# EAGLE design M0 DC Closed Loop Servo (EAGLE 8.4.3)
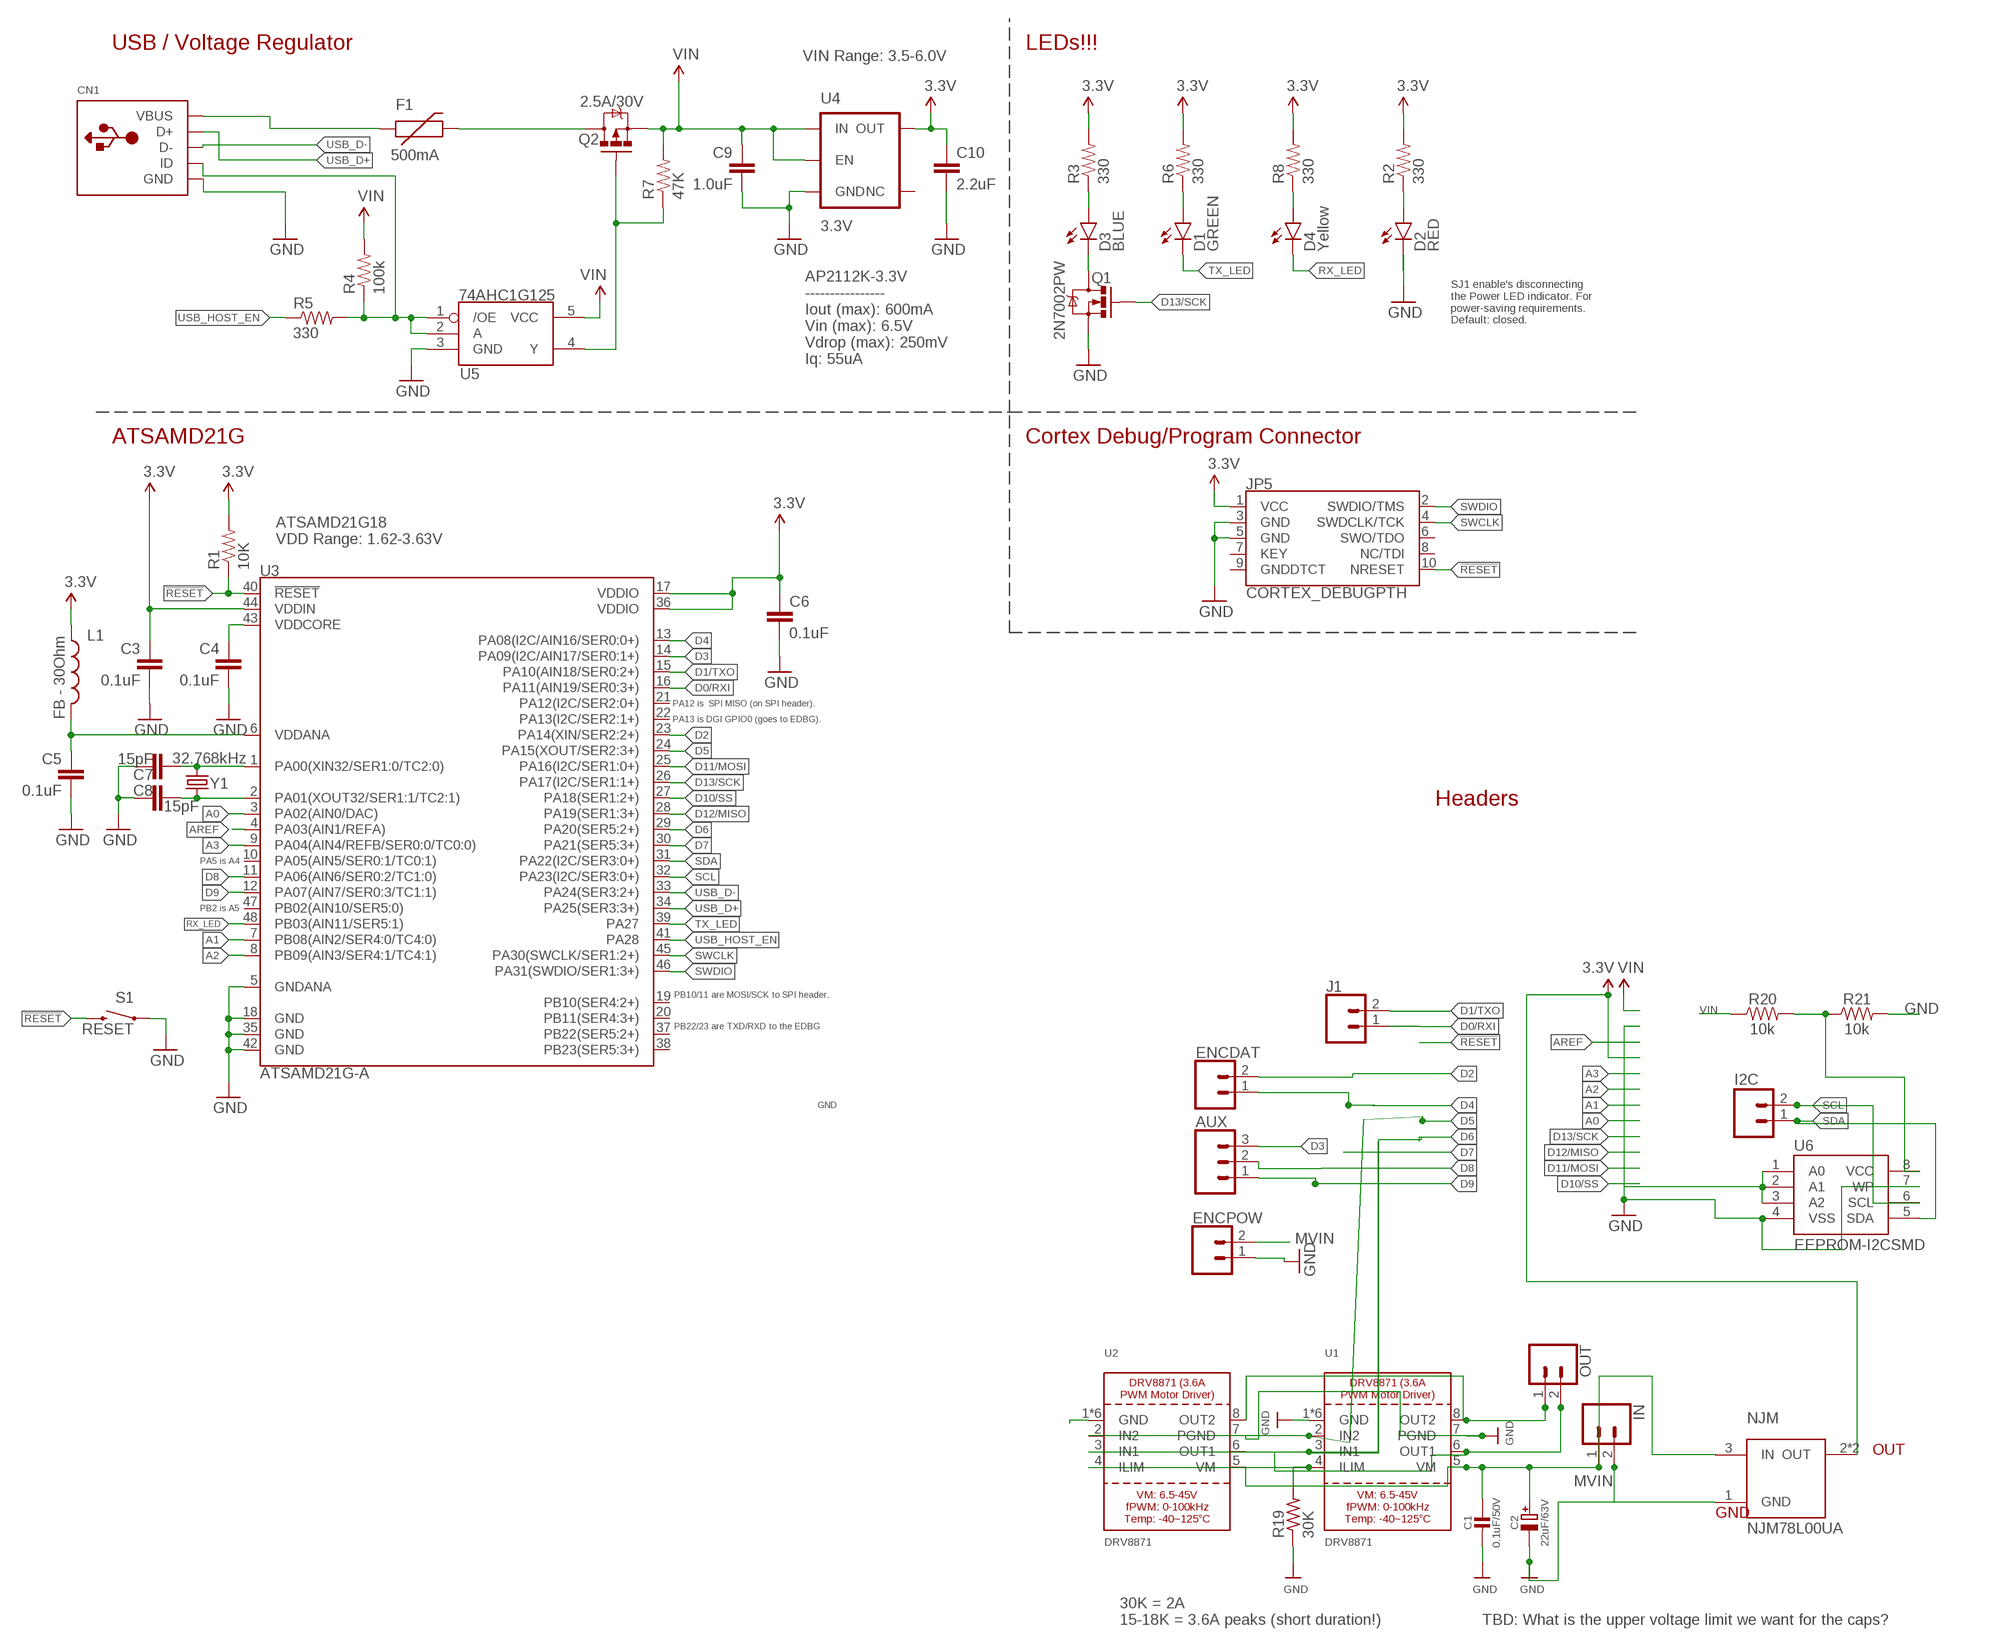
[diagram p0: schematic, sheet 1]

## Parts
AUX  CONN_03LONGPADS  [1X03_LONGPADS]
C1  0.1uF/50V  CAP_CERAMIC0805-NOOUTLINE  [0805-NO]
C2  22uF/63V  CAP_ELECTROLYTICPANASONIC_D  [PANASONIC_D]
C3  0.1uF  0.1UF-16V(+-10%)(0402)  [0402-CAP]
C4  0.1uF  0.1UF-16V(+-10%)(0402)  [0402-CAP]
C5  0.1uF  0.1UF-16V(+-10%)(0402)  [0402-CAP]
C6  0.1uF  0.1UF-16V(+-10%)(0402)  [0402-CAP]
C7  15pF  15PF-50V(+-5%)(0402)  [0402-CAP]
C8  15pF  15PF-50V(+-5%)(0402)  [0402-CAP]
C9  1.0uF  1.0UF-25V-+80/-20(0805)"  [0805-CAP]
C10  2.2uF  2.2UF-10V-20%(0603)  [0603-CAP]
CN1  USBMINIB  [USB-MINIB]
D1  GREEN  LED-GREEN0603  [LED-0603]
D2  RED  LED-RED0603  [LED-0603]
D3  BLUE  LED-BLUE0603  [LED-0603]
D4  Yellow  LED-YELLOW0603  [LED-0603]
ENCDAT  CONN_02  [1X02]
ENCPOW  CONN_02  [1X02]
F1  500mA  PTCSMD  [PTC-1206]
I2C  M021X02_NO_SILK  [1X02_NO_SILK@1]
IN  CONN_02PTH3  [1X02_LONGPADS]
J1  CONN_02  [1X02]
JP5  CORTEX_DEBUGPTH  [2X5-PTH-1.27MM]
L1  FB - 30Ohm  INDUCTOR0603  [0603]
NJM  NJM78L00UA  AP1117Y33G-13  [SOT89]
OUT  CONN_02PTH3  [1X02_LONGPADS]
Q1  2N7002PW  MOSFET-NCHANNEL2N7002PW  [SOT323]
Q2  2.5A/30V  MOSFET-PCHANNELDMG2307L  [SOT23-3]
R1  10K  10KOHM-1/10W-1%(0603)0603  [0603-RES]
R2  330  330OHM1/10W1%(0603)  [0603-RES]
R3  330  330OHM1/10W1%(0603)  [0603-RES]
R4  100k  100KOHM-1/10W-1%(0603)  [0603-RES]
R5  330  330OHM1/10W1%(0603)  [0603-RES]
R6  330  330OHM1/10W1%(0603)  [0603-RES]
R7  47K  47KOHM1/10W1%(0603)  [0603-RES]
R8  330  330OHM1/10W1%(0603)  [0603-RES]
R19  30K  FLIPFLOP-RES  [0805-THM]
R20  10k  10KOHM-0603-1/10W-1%  [0603]
R21  10k  10KOHM-0603-1/10W-1%  [0603]
S1  RESET  SWITCH-MOMENTARY-2SMD-4.6X2.8MM  [TACTILE_SWITCH_SMD_4.6X2.8MM]
U1  DRV8871  [HSOP8]
U2  DRV8871  [HSOP8]
U3  ATSAMD21G-A  [TQFP-48]
U4  3.3V  V_REG_AP2112K-3.3V  [SOT23-5]
U5  74AHC1G125  [SOT23-5]
U6  EEPROM-I2CSMD  [SO08]
Y1  32.768kHz  CRYSTAL3.2X1.5MM  [CRYSTAL-SMD-3.2X1.5MM]

## Nets
3.3V: C3.1 C6.1 C10.1 JP5.1(VCC) L1.1 NJM.2(OUT) NJM.2@1(OUT) R1.2 R2.2 R3.2 R6.2 R8.2 U3.17(VDDIO) U3.36(VDDIO) U3.44(VDDIN) U4.5(OUT)
!RESET: JP5.10(NRESET) R1.1 S1.3 S1.4 U3.40(!RESET!)
A0: U3.3(PA02(AIN0/DAC))
A1: U3.7(PB08(AIN2/SER4:0/TC4:0))
A2: U3.8(PB09(AIN3/SER4:1/TC4:1))
A3: U3.9(PA04(AIN4/REFB/SER0:0/TC0:0))
AREF: U3.4(PA03(AIN1/REFA))
D0/RXI: J1.1 U3.16(PA11(AIN19/SER0:3+))
D1/TXO: J1.2 U3.15(PA10(AIN18/SER0:2+))
D2: ENCDAT.2 U3.23(PA14(XIN/SER2:2+))
D3: AUX.3 U3.14(PA09(I2C/AIN17/SER0:1+))
D4: ENCDAT.1 U3.13(PA08(I2C/AIN16/SER0:0+))
D5: U1.2(IN2) U2.2(IN2) U3.24(PA15(XOUT/SER2:3+))
D6: U1.3(IN1) U2.3(IN1) U3.29(PA20(SER5:2+))
D7: U3.30(PA21(SER5:3+))
D8: AUX.2 U3.11(PA06(AIN6/SER0:2/TC1:0))
D9: AUX.1 U3.12(PA07(AIN7/SER0:3/TC1:1))
D10/SS: U3.27(PA18(SER1:2+))
D11/MOSI: U3.25(PA16(I2C/SER1:0+))
D12/MISO: U3.28(PA19(SER1:3+))
D13/SCK: Q1.1(G) U3.26(PA17(I2C/SER1:1+))
GND: C1.2 C2.- C3.2 C4.2 C5.2 C6.2 C7.1 C8.2 C9.2 C10.2 CN1.GND ENCPOW.1 IN.2 JP5.3(GND) JP5.5(GND) NJM.1(GND) Q1.2(S) R19.1 R21.2 S1.1 S1.2 U1.1(GND) U1.7(PGND) U1.GND U1.P$1(GND) U1.P$2(GND) U1.P$3(GND) U1.P$4(GND) U2.1(GND) U2.7(PGND) U2.GND U2.P$1(GND) U2.P$2(GND) U2.P$3(GND) U2.P$4(GND) U3.5(GNDANA) U3.18(GND) U3.35(GND) U3.42(GND) U4.2(GND) U5.3(GND) U6.1(A0) U6.2(A1) U6.3(A2) U6.4(VSS) U6.7(WP)
MVIN: C1.1 C2.+ ENCPOW.2 IN.1 NJM.3(IN) U1.5(VM) U2.5(VM)
N$1: CN1.VBUS F1.1
N$2: C7.2 U3.1(PA00(XIN32/SER1:0/TC2:0)) Y1.P$2
N$3: D3.C Q1.3(D)
N$4: C8.1 U3.2(PA01(XOUT32/SER1:1/TC2:1)) Y1.P$1
N$5: D2.A R2.1
N$6: D3.A R3.1
N$7: F1.2 Q2.3(D)
N$8: CN1.ID R4.1 R5.2 U5.1(/OE) U5.2(A)
N$9: Q2.1(G) R7.1 U5.4(Y)
N$10: D1.A R6.1
N$11: D4.A R8.1
N$12: D2.C
N$15: R20.2 R21.1 U6.8(VCC)
N$20: R19.2 U1.4(ILIM) U2.4(ILIM)
OUT1: OUT.2 U1.6(OUT1) U2.6(OUT1)
OUT2: OUT.1 U1.8(OUT2) U2.8(OUT2)
RX_LED: D4.C U3.48(PB03(AIN11/SER5:1))
SCL: I2C.2 U3.32(PA23(I2C/SER3:0+)) U6.6(SCL)
SDA: I2C.1 U3.31(PA22(I2C/SER3:0+)) U6.5(SDA)
SWCLK: JP5.4(SWDCLK/TCK) U3.45(PA30(SWCLK/SER1:2+))
SWDIO: JP5.2(SWDIO/TMS) U3.46(PA31(SWDIO/SER1:3+))
TX_LED: D1.C U3.39(PA27)
USB_D+: CN1.D+ U3.34(PA25(SER3:3+))
USB_D-: CN1.D- U3.33(PA24(SER3:2+))
USB_HOST_EN: R5.1 U3.41(PA28)
VDDANA: C5.1 L1.2 U3.6(VDDANA)
VDDCORE: C4.1 U3.43(VDDCORE)
VIN: C9.1 Q2.2(S) R4.2 R7.2 R20.1 U4.1(IN) U4.3(EN) U5.5(VCC)
Unconnected: JP5.6(SWO/TDO) JP5.7(KEY) JP5.8(NC/TDI) JP5.9(GNDDTCT) U3.10(PA05(AIN5/SER0:1/TC0:1)) U3.19(PB10(SER4:2+)) U3.20(PB11(SER4:3+)) U3.21(PA12(I2C/SER2:0+)) U3.22(PA13(I2C/SER2:1+)) U3.37(PB22(SER5:2+)) U3.38(PB23(SER5:3+)) U3.47(PB02(AIN10/SER5:0)) U4.4(NC)

## Notes on the sheet
- USB / Voltage Regulator | LEDs!!!
- VIN Range: 3.5-6.0V
- AP2112K-3.3V
  ----------------
  Iout (max): 600mA 
  Vin (max): 6.5V
  Vdrop (max): 250mV
  Iq: 55uA
- SJ1 enable's disconnecting
  the Power LED indicator. For
  power-saving requirements.
  Default: closed.
- ATSAMD21G | Cortex Debug/Program Connector
- ATSAMD21G18
  VDD Range: 1.62-3.63V
- PA12 is  SPI MISO (on SPI header).
- PA13 is DGI GPIO0 (goes to EDBG).
- Headers
- PA5 is A4
- PB2 is A5
- PB10/11 are MOSI/SCK to SPI header.
- PB22/23 are TXD/RXD to the EDBG
- OUT
- GND
- 30K = 2A
  15-18K = 3.6A peaks (short duration!)
- TBD: What is the upper voltage limit we want for the caps?

## Library data of the parts
AUX = SparkFun-Connectors:CONN_03: Multi connection point. Often used as Generic Header-pin footprint for 0.1 inch spaced/style header connections On any of the 0.1 inch spaced packages, you can populate with these: Break Away Headers - Straight <https://www.sparkfun.com/products/116> (PRT-00116) Break Away Male Headers - Right Angle <https://www.sparkfun.com/products/553> (PRT-00553) Female Headers <https://www.sparkfun.com/products/115> (PRT-00115) Break Away Headers - Machine Pin <https://www.sparkfun.com/products/117> (PRT-00117) Break Away Female Headers - Swiss Machine Pin <https://www.sparkfun.com/products/743> (PRT-00743) Stackable Header - 3 Pin (Female, 0.1") <https://www.sparkfun.com/products/13875> (PRT-13875) For SCREWTERMINALS and SPRING TERMINALS visit here: Screw Terimnals on SparkFun.com <https://www.sparkfun.com/search/results?term=Screw+Terminals> (5mm/3.5mm/2.54mm spacing) This device is also useful as a general connection point to wire up your design to another part of your project. Our various solder wires solder well into these plated through hole pads. Hook-Up Wire - Assortment (Stranded, 22 AWG) <https://www.sparkfun.com/products/11375> (PRT-11375) Hook-Up Wire - Assortment (Solid Core, 22 AWG) <https://www.sparkfun.com/products/11367> (PRT-11367) View the entire wire category on our website here <https://www.sparkfun.com/categories/141> Special notes: Molex polarized connector foot print use with SKU : PRT-08232 with associated crimp pins and housings.
C1 = microbuilder:CAP_CERAMIC: Ceramic Capacitors For new designs, use the packages preceded by an '_' character since they are more reliable: The following footprints should be used on most boards: _0402 - Standard footprint for regular board layouts _0603 - Standard footprint for regular board layouts _0805 - Standard footprint for regular board layouts _1206 - Standard footprint for regular board layouts For extremely tight-pitch boards where space is at a premium, the following 'micro-pitch' footprints can be used (smaller pads, no silkscreen outline, etc.): _0402MP - Micro-pitch footprint for very dense/compact boards _0603MP - Micro-pitch footprint for very dense/compact boards _0805MP - Micro-pitch footprint for very dense/compact boards _1206MP - Micro-pitch footprint for very dense/compact boards
C2 = microbuilder:CAP_ELECTROLYTIC: Electrolytic Capacitors SMT PANASONIC_C - Size C Panasonic Electrolytic Aluminum Capacitor 47µF 16V 20% Electrolytic Capacitor [Digikey: PCE3890TR-ND] PANASONIC_D - Size D Panasonic Electrolytic Aluminum Capacitor 100µF 25V 20% Electrolytic Capacitor [Digikey: PCE3898TR-ND] PTH 3.5 mm grid, 8 mm diameter ... 3.5 mm grid, 10 mm diameter ...
C3-C6 = SparkFun-Capacitors:0.1UF-16V(+-10%)(0402); PROD_ID: CAP-12416
C7 C8 = samd21-temp:15PF-50V(+-5%)(0402); PROD_ID: CAP-13063
C9 = SparkFun-Capacitors:1.0UF-25V-+80/-20(0805): CAP-11625; PROD_ID: CAP-11625
C10 = SparkFun-Capacitors:2.2UF-10V-20%(0603): CAP-07888; PROD_ID: CAP-07888
CN1 = adafruit:USB: USB Connectors USBMINIB - Surface Mount Female Mini-B USB Connector 4UConnector: 06564 By microbuilder.eu Thru-hole RA Female Mini-B USB Connector 4UConnector: 18732 By ladyada.net
D1 = SparkFun-LED:LED-GREEN: Various green LEDs Green LEDs used in SFE Production 0603- DIO-00821 LARGE- DIO-00862 LILYPAD- DIO-09910; PROD_ID: DIO-00821
D2 = SparkFun-LED:LED-RED: Assorted Red LEDs LilyPad 1206- DIO-09912 1206- DIO-00809 0603- DIO-00819 "SMART" means more efficient and expensive; PROD_ID: DIO-00819
D3 = SparkFun-LED:LED-BLUE: Blue LEDs for production use Various blue LEDs stocked by SparkFun production 0603 - DIO-08575 Rebel - DIO-09553 1206 - DIO-09911; PROD_ID: DIO-08575
D4 = SparkFun-LED:LED-YELLOW: Yellow SMD LEDs LilyPad 1206- DIO-09909 0603- DIO-09003 "SMART" means more efficient and expensive; PROD_ID: DIO-09003
ENCDAT ENCPOW IN J1 OUT = SparkFun-Connectors:CONN_02: Multi connection point. Often used as Generic Header-pin footprint for 0.1 inch spaced/style header connections On any of the 0.1 inch spaced packages, you can populate with these: Break Away Headers - Straight <https://www.sparkfun.com/products/116> (PRT-00116) Break Away Male Headers - Right Angle <https://www.sparkfun.com/products/553> (PRT-00553) Female Headers <https://www.sparkfun.com/products/115> (PRT-00115) Break Away Headers - Machine Pin <https://www.sparkfun.com/products/117> (PRT-00117) Break Away Female Headers - Swiss Machine Pin <https://www.sparkfun.com/products/743> (PRT-00743) For SCREWTERMINALS and SPRING TERMINALS visit here: Screw Terimnals on SparkFun.com <https://www.sparkfun.com/search/results?term=Screw+Terminals> (5mm/3.5mm/2.54mm spacing) This device is also useful as a general connection point to wire up your design to another part of your project. Our various solder wires solder well into these plated through hole pads. Hook-Up Wire - Assortment (Stranded, 22 AWG) <https://www.sparkfun.com/products/11375> (PRT-11375) Hook-Up Wire - Assortment (Solid Core, 22 AWG) <https://www.sparkfun.com/products/11367> (PRT-11367) View the entire wire category on our website here <https://www.sparkfun.com/categories/141> Special notes: Molex polarized connector foot print use with: PRT-08233 with associated crimp pins and housings. 2.54_SCREWTERM for use with PRT-10571. 3.5mm Screw Terminal footprints for PRT-08084 5mm Screw Terminal footprints for use with PRT-08432
F1 = SparkFun-PowerIC:PTC: Resettable Fuse PTC Resettable Fuse. Spark Fun Electronics SKU : COM-08357; PROD_ID: RES-11150
I2C = SparkFun-Connectors:M02: Standard 2-pin 0.1" header. Use with - straight break away headers ( PRT-00116) - right angle break away headers (PRT-00553) - swiss pins (PRT-00743) - machine pins (PRT-00117) - female headers (PRT-00115) Molex polarized connector foot print use with: PRT-08233 with associated crimp pins and housings. 2.54_SCREWTERM for use with PRT-10571. 3.5mm Screw Terminal footprints for PRT-08084 5mm Screw Terminal footprints for use with PRT-08432
JP5 = samd21-temp:CORTEX_DEBUG: Cortex Debug Connector Datasheet <http://infocenter.arm.com/help/topic/com.arm.doc.faqs/attached/13634/cortex_debug_connectors.pdf>
L1 = SparkFun-Passives:INDUCTOR: Inductors Basic Inductor/Choke - 0603 and 1206. Footprints are not proven and vary greatly between part numbers. INDUCTOR POWER 3.3UH 4.0A SMD 0.197" L x 0.197" W x 0.177" H (5.00mm x 5.00mm x 4.50mm); PROD_ID: RES-07859
NJM = AP1117Y33G-13:AP1117Y33G-13
Q1 = SparkFun-DiscreteSemi:MOSFET-NCHANNEL: Common NMOSFET Parts MFG P/N Store ID Prod ID FDD8780 TRANS-09984 SI7820DN TRANS-11055 FDS6630A IC-08089 2N7002PW TRANS-11151 FQP30N06L COM-10213 TRANS-10060 BSS123LT1G TRANS-08345 BSS138 TRANS-00830 BS170 2N7000; PROD_ID: TRANS-11151
Q2 = SparkFun-DiscreteSemi:MOSFET-PCHANNEL: Generic PMOSFET IRLML2244 - TRANS-11153 (SOT-23 -20V -4.3A) (1.Gate 2.Source 3.Drain) FQP27P06 - COM-10349 <http://www.sparkfun.com/products/10349> (TO-220 -60V -27A) (1.Gate 2.Source 3.Drain); PROD_ID: TRANS-11308
R1 = SparkFun-Resistors:10KOHM-1/10W-1%(0603): RES-00824; PROD_ID: RES-00824
R2 R3 R5 R6 R8 = SparkFun-Resistors:330OHM1/10W1%(0603): RES-00818; PROD_ID: RES-00818
R4 = SparkFun-Resistors:100KOHM-1/10W-1%(0603): RES-07828; PROD_ID: RES-07828
R7 = SparkFun-Resistors:47KOHM1/10W1%(0603): RES-07871; PROD_ID: RES-07871
R19 = adafruit:FLIPFLOP-RES: Flip Flop resistor An 0805 resistor inside a standard 1/4W 5% resistor. Makes for easy mods
R20 R21 = SparkFun-Resistors:10KOHM: 10kΩ resistor A resistor is a passive two-terminal electrical component that implements electrical resistance as a circuit element. Resistors act to reduce current flow, and, at the same time, act to lower voltage levels within circuits. - Wikipedia; PROD_ID: RES-00824
S1 = samd21-temp:SWITCH-MOMENTARY-2: Various NO switches- pushbuttons, reed, etc; PROD_ID: SWCH-13065
U1 U2 = microbuilder:DRV8871: DRV8871 - 3.6A PWM Motor Driver
U3 = samd21-temp:ATSAMD21G: Atmel SAMD21G SMART ARM-Based Microcontroller The Atmel ® | SMART ™ SAM D21 is a series of low-power microcontrollers using the 32-bit ARM ® Cortex ® -M0+ processor, and ranging from 32- to 64-pins with up to 256KB Flash and 32KB of SRAM. The SAM D21 devices operate at a maximum frequency of 48MHz and reach 2.46 CoreMark/MHz. They are designed for simple and intuitive migration with identical peripheral modules, hex compatible code, identical linear address map and pin compatible migration paths between all devices in the product series. All devices include intelligent and flexible peripherals, Atmel Event System for inter-peripheral signaling, and support for capacitive touch button, slider and wheel user interfaces.; PROD_ID: IC-13064
U4 = SparkFun-PowerIC:V_REG_AP2112: AP2112 - 600mA CMOS LDO Regulator w/ Enable The AP2112 is CMOS process low dropout linear regulator with enable function, the regulator delivers a guaranteed 600mA (min.) continuous load current. Features Output Voltage Accuracy: ±1.5% Output Current: 600mA (Min.) Foldback Short Current Protection: 50mA Enable Function to Turn ON/OFF VOUT Low Dropout Voltage (3.3V): 250mV (Typ.) @IOUT=600mA Excellent Load Regulation: 0.2%/A (Typ.) Excellent Line Regulation: 0.02%/V (Typ.) Low Quiescent Current: 55μA (Typ.) Low Standby Current: 0.01μA (Typ.) Low Output Noise: 50μVRMS PSRR: 100Hz -65dB, 1kHz -65dB OTSD Protection Stable with 1.0μF Flexible Cap: Ceramic, Tantalum and Aluminum Electrolytic Operation Temperature Range: -40°C to 85°C ESD: MM 400V, HBM 4000V; PROD_ID: VREG-12457
U5 = SparkFun-DigitalIC:74AHC1G125: Single bus buffer gate with 3-state output; PROD_ID: IC-11920
U6 = SparkFun-IC-Memory:EEPROM-I2C: I2C EEPROMs, 24LC256 and others 24LC256 Series 256 kb I2C 2 Wire (32 k x 8 Bit) 2.5 V Serial EEPROM SMD - SOIC-8 Datasheet SparkFun Products SparkFun UDB5 - PIC UAV Development Board <https://www.sparkfun.com/products/11703> (GPS-11703); PROD_ID: IC-09714; VALUE: 24LC256
Y1 = samd21-temp:CRYSTAL: Various standard crystals. Proven footprints.; PROD_ID: XTAL-13062

## Board
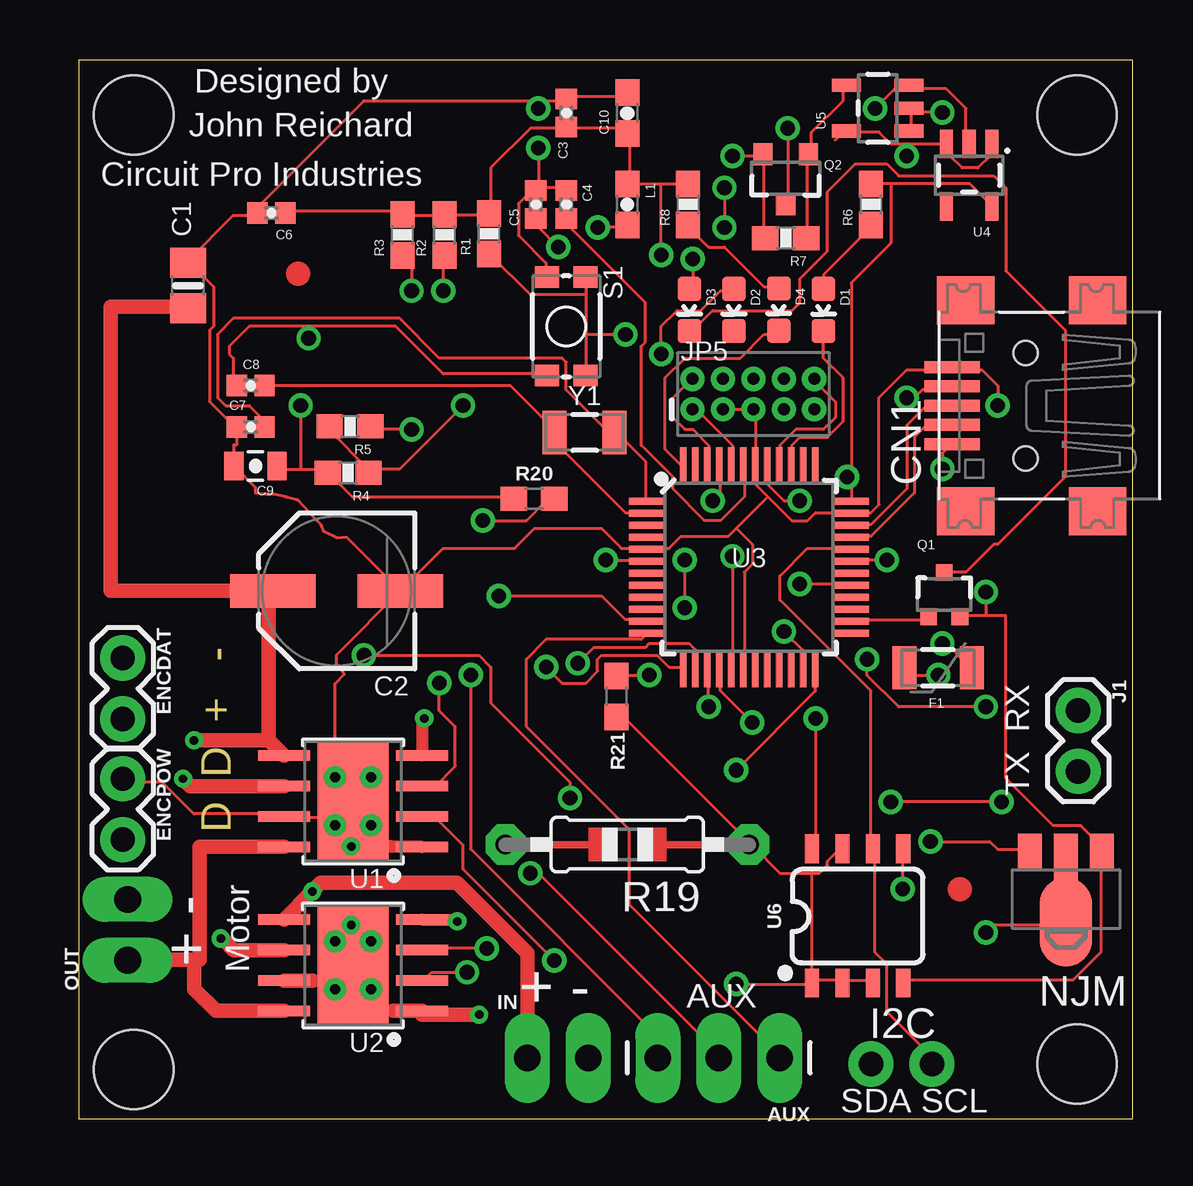
[diagram p1: board, top side]
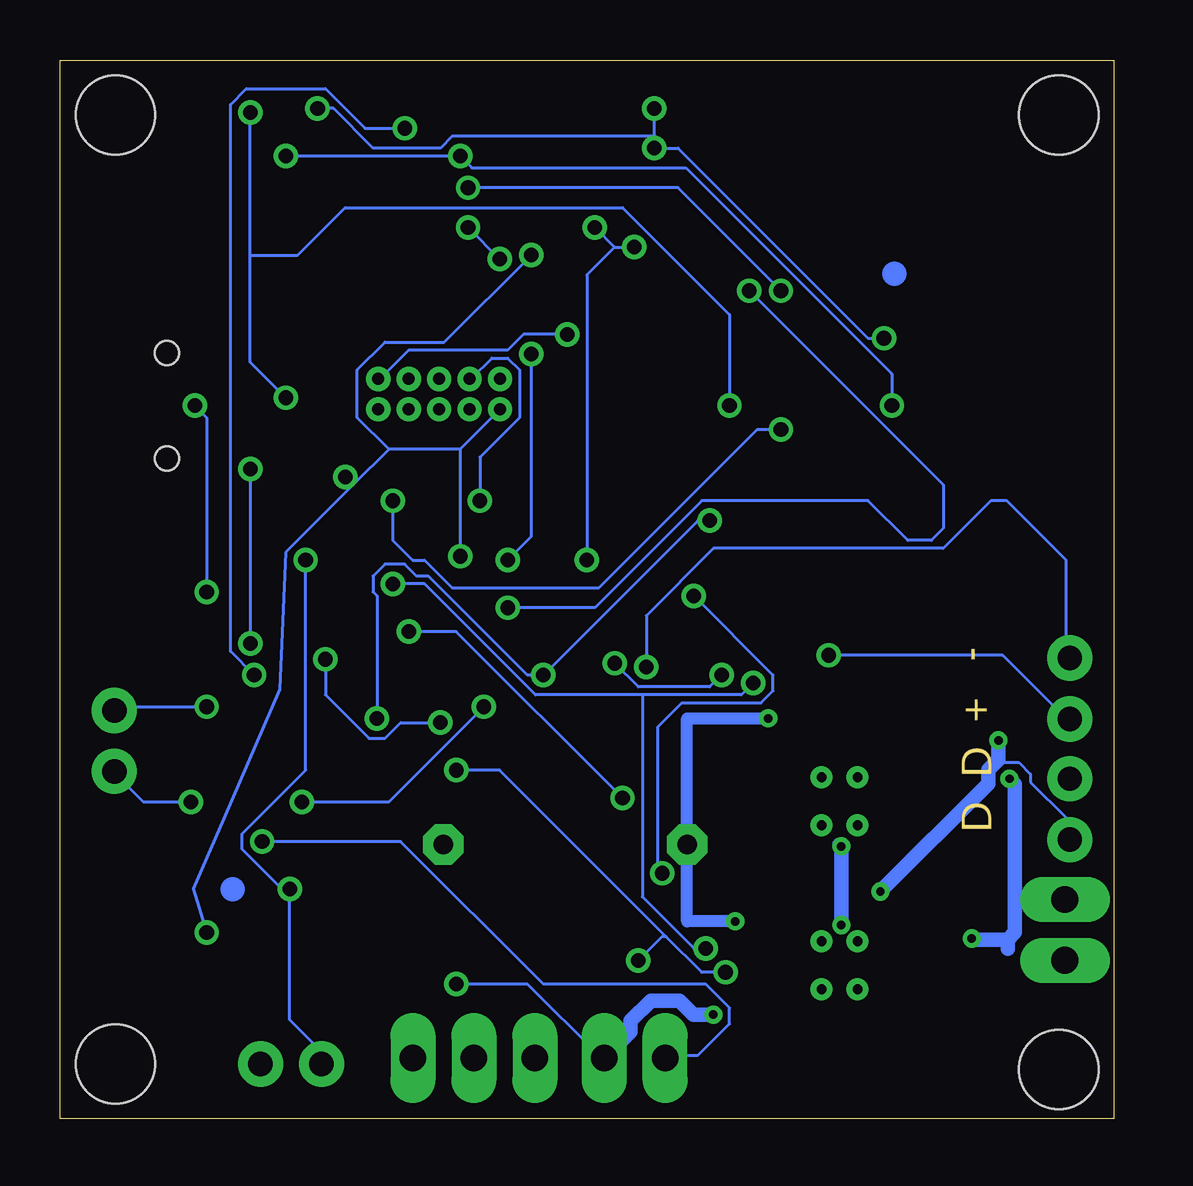
[diagram p2: board, bottom side, seen from below]

Size 43.92 x 44.12 mm. Coordinates in mm from the lower left corner, seen from the top.
Outline: 0,0 43.92,0 43.92,44.12 0,44.12 0,0
Copper layers (1*16): Top 0.035mm / dielectric 1.5mm / Bottom 0.035mm
Design rules "default *": minimum track width 5mil, minimum drill 24mil, track to track 8mil, track to pad 8mil, pad to pad 8mil, via to via 8mil, smd to smd 8mil, copper to edge 40mil, drill to drill 8mil, minimum pad ring 10mil, minimum via ring 8mil, stop-mask expansion 4mil, vias tented up to drill 0mil, thermal gap 10mil
Holes 3.3 mm at 41.61,41.83 2.29,41.83 2.29,2.06 41.61,2.29

### Footprints (pad centres in the part's own frame; a part is rotated, then mirrored left to right if it is on the bottom)
1X03_LONGPADS = drill 1.118 pad 1.88 long: 1 0,0; 2 2.54,0; 3 5.08,0
0805-NO = smd 1.24 x 1.5: 1 -0.95,0; 2 0.95,0
PANASONIC_D = smd 3.556 x 1.4: + 2.654,0; - -2.654,0
0402-CAP = smd 0.85 x 0.9: 1 -0.58,0; 2 0.58,0
0805-CAP = smd 0.8 x 1.2: 1 -0.9,0; 2 0.9,0
0603-CAP = smd 1.1 x 1: 1 -0.85,0; 2 0.85,0
USB-MINIB = smd 0.5 x 2.308: D+ 0,4.064; D- -0.8,4.064; GND 1.6,4.064; ID 0.8,4.064; VBUS -1.6,4.064 | smd 2 x 2.4: GND1 -4.4,-2; GND2 -4.4,3.5; GND3 4.4,3.5; GND4 4.4,-2 | hole 1: -2.2,1; 2.2,1
LED-0603 = smd 1 x 1: A 0,-0.877; C 0,0.877
1X02 = drill 1.016 pad 1.88: 1 0,0; 2 2.54,0
PTC-1206 = smd 1 x 1.8: 1 -1.4,0; 2 1.4,0
1X02_NO_SILK@1 = drill 1.016 pad 1.88: 1 0,0; 2 2.54,0
1X02_LONGPADS = drill 1.118 pad 1.88 long: 1 0,0; 2 2.54,0
2X5-PTH-1.27MM = drill 0.508 pad 1: 1 -2.54,-0.635; 2 -2.54,0.635; 3 -1.27,-0.635; 4 -1.27,0.635; 5 0,-0.635; 6 0,0.635; 7 1.27,-0.635; 8 1.27,0.635; 9 2.54,-0.635; 10 2.54,0.635
0603 = smd 1.1 x 1: 1 -0.85,0; 2 0.85,0
SOT89 = smd 1 x 1.5: 1 -1.499,-1.981; 3 1.499,-1.981 | smd 1 x 2: 2 0,-1.727 | smd 2.2 x 3.7: 2@1 0,0.94
SOT323 = smd 0.7 x 0.7: 1 -0.65,-0.925; 2 0.65,-0.925; 3 0,0.925
SOT23-3 = smd 0.8 x 0.9: 1 -0.95,-1; 2 0.95,-1; 3 0,1.1
0603-RES = smd 1.1 x 1: 1 -0.85,0; 2 0.85,0
0805-THM = drill 0.813 pad 1.676 octagon: 1 -5.08,0; 2 5.08,0
TACTILE_SWITCH_SMD_4.6X2.8MM = smd 0.9 x 1: 1 -2.05,-0.8; 2 2.05,-0.8; 3 2.05,0.8; 4 -2.05,0.8
HSOP8 = smd 0.45 x 2.15: 1 -1.905,-2.875; 2 -0.635,-2.875; 3 0.635,-2.875; 4 1.905,-2.875; 5 1.905,2.875; 6 0.635,2.875; 7 -0.635,2.875; 8 -1.905,2.875 | smd 4.9 x 2.95: GND 0,0 | drill 0.4: P$1 -1,0.75; P$2 -1,-0.75; P$3 1,-0.75; P$4 1,0.75
TQFP-48 = smd 1.5 x 0.28: 1 -4.25,2.75; 2 -4.25,2.25; 3 -4.25,1.75; 4 -4.25,1.25; 5 -4.25,0.75; 6 -4.25,0.25; 7 -4.25,-0.25; 8 -4.25,-0.75; 9 -4.25,-1.25; 10 -4.25,-1.75; 11 -4.25,-2.25; 12 -4.25,-2.75; 25 4.25,-2.75; 26 4.25,-2.25; 27 4.25,-1.75; 28 4.25,-1.25; 29 4.25,-0.75; 30 4.25,-0.25; 31 4.25,0.25; 32 4.25,0.75; 33 4.25,1.25; 34 4.25,1.75; 35 4.25,2.25; 36 4.25,2.75 | smd 0.28 x 1.5: 13 -2.75,-4.25; 14 -2.25,-4.25; 15 -1.75,-4.25; 16 -1.25,-4.25; 17 -0.75,-4.25; 18 -0.25,-4.25; 19 0.25,-4.25; 20 0.75,-4.25; 21 1.25,-4.25; 22 1.75,-4.25; 23 2.25,-4.25; 24 2.75,-4.25; 37 2.75,4.25; 38 2.25,4.25; 39 1.75,4.25; 40 1.25,4.25; 41 0.75,4.25; 42 0.25,4.25; 43 -0.25,4.25; 44 -0.75,4.25; 45 -1.25,4.25; 46 -1.75,4.25; 47 -2.25,4.25; 48 -2.75,4.25
SOT23-5 = smd 0.55 x 1.2: 1 -0.95,-1.3; 2 0,-1.3; 3 0.95,-1.3; 4 0.95,1.3; 5 -0.95,1.3
SO08 = smd 0.6 x 1.2: 1 -1.905,-2.8; 2 -0.635,-2.8; 3 0.635,-2.8; 4 1.905,-2.8; 5 1.905,2.8; 6 0.635,2.8; 7 -0.635,2.8; 8 -1.905,2.8
CRYSTAL-SMD-3.2X1.5MM = smd 1 x 1.8: P$1 -1.25,0; P$2 1.25,0

### Placement (x,y rotation side)
AUX  29.21,2.54 180 top
C1  4.55,34.72 90 top
C2  10.74,22 180 top
C3  20.32,41.91 90 top
C4  20.32,38.1 90 top
C5  19.05,38.1 90 top
C6  8.03,37.74 180 top
C7  7.16,28.83 0 top
C8  7.16,30.56 180 top
C9  7.37,27.2 180 top
C10  22.86,41.91 90 top
CN1  40.46,29.72 90 top
D1  31.04,33.71 180 top
D2  27.3,33.71 180 top
D3  25.45,33.71 180 top
D4  29.18,33.72 180 top
ENCDAT  1.83,19.2 270 top
ENCPOW  1.83,14.17 270 top
F1  35.81,18.8 180 top
I2C  33.02,2.29 0 top
IN  18.69,2.54 0 top
J1  41.66,17.02 270 top
JP5  28.12,30.2 0 top
L1  22.86,38.1 270 top
NJM  41.15,9.14 180 top
OUT  2.03,6.6 90 top
Q1  36.07,21.84 0 top
Q2  29.46,39.19 180 top
R1  17.09,36.88 90 top
R2  15.24,36.83 90 top
R3  13.49,36.83 90 top
R4  11.23,26.92 180 top
R5  11.3,28.85 180 top
R6  33.02,38.1 90 top
R7  29.46,36.7 180 top
R8  25.4,38.1 90 top
R19  22.86,11.43 180 top
R20  18.97,25.83 0 top
R21  22.4,17.6 270 top
S1  20.32,33.02 270 top
U1  11.43,13.23 90 top
U2  11.43,6.4 90 top
U3  27.94,22.99 0 top
U4  37.11,39.32 180 top
U5  33.3,42.11 90 top
U6  32.46,8.46 0 top
U$7  [CIRCLE-1MM-3R]  36.73,9.58 0 top
U$8  [CIRCLE-1MM-3R]  9.14,35.2 0 top
Y1  21.08,28.6 0 top

### Tracks (layer width: path | path; a pad name or v marks a point on that pad's centre or on a via)
3.3V  (via drill 0.61)
  Top 0.127: C6.1 8.75,37.81 13.37,37.81 R3.2 13.54,37.64 15.19,37.64 R2.2 15.35,37.64 17,37.64 R1.2 17.17,37.81 17.17,39.62 18.82,41.27 20.31,41.27 C3.1 20.47,41.27 22.62,41.27 22.78,41.11 C10.1 22.95,40.95 22.95,38.96 | 33.85,38.96 37.15,38.96 37.97,38.14 U4.5 | 33.85,38.96 33.02,38.96 R6.2 | NJM.2 41.27,10.73 41.27,8.26 NJM.2@1 41.11,8.09 38.14,8.09 v37.81,7.76 | 32.19,26.75 32.19,34.84 33.85,36.49 33.85,38.96 | 32.19,26.75 32.19,25.76 U3.36 | 22.95,38.96 24.27,38.96 | 24.27,38.96 25.26,38.96 R8.2 | 22.95,38.96 L1.1 | v27.24,23.44 27.24,18.82 U3.17 | U3.44 27.24,27.24 27.24,28.07 25.59,29.72 JP5.1 | v24.27,35.99 24.27,38.96 | v32.03,26.75 32.19,26.75
  Bottom 0.127: 27.24,27.9 v27.24,23.44 | JP5.1 27.24,27.9 | v24.27,35.99 27.9,32.36 30.38,32.36 31.53,31.2 31.53,29.22 30.21,27.9 | 27.24,27.9 30.21,27.9 | v37.81,7.76 38.37,9.59 37.1,12.51 34.76,17.89 34.51,23.61 31.7,26.42 | 30.21,27.9 31.7,26.42 | 31.7,26.42 v32.03,26.75
!RESET  (via drill 0.61)
  Top 0.127: 21.13,34.34 21.13,35 S1.4 | 21.13,34.34 21.13,32.69 | 21.13,32.69 21.13,31.04 S1.3 | 21.13,34.34 18.82,34.34 17.17,35.99 R1.1 | U3.40 29.22,27.24 29.22,28.07 29.88,28.73 31.04,28.73 31.53,29.22 31.53,29.88 30.71,30.71 JP5.10 | 21.13,32.69 v22.78,32.69
  Bottom 0.127: v22.78,32.69 24.6,32.69 25.26,32.03 29.39,32.03 30.54,30.87 JP5.10
D0/RXI  (via drill 0.61)
  Top 0.127: v28.07,16.51 26.75,17.83 26.75,18.66 U3.16 | v32.85,19.15 32.85,18.49 34.18,17.17 v37.81,17.17
  Bottom 0.127: v28.07,16.51 29.72,16.51 30.38,15.85 31.04,15.85 32.85,17.67 v32.85,19.15 | v37.81,17.17 41.6,17.17 J1.1
D1/TXO  (via drill 0.61)
  Top 0.127: v26.25,17.17 26.25,18.66 U3.15 | v38.47,13.21 v33.85,13.21
  Bottom 0.127: v26.25,17.17 30.21,13.21 v33.85,13.21 | v38.47,13.21 40.45,13.21 41.6,14.36 J1.2
D2  (via drill 0.61)
  Top 0.127: v29.39,20.31 30.21,19.48 30.21,18.82 U3.23 | v20.47,13.37 20.47,14.03 17.17,17.34 17.17,18.82 16.68,19.32 v11.89,19.32
  Bottom 0.127: v29.39,20.31 27.41,20.31 v20.47,13.37 | v11.89,19.32 4.62,19.32 1.98,16.68 ENCDAT.2
D3  (via drill 0.61)
  Top 0.127: v20.8,18.99 21.46,19.65 23.61,19.65 23.77,19.81 25.43,19.81 25.76,19.48 25.76,18.82 U3.14 | v16.34,18.49 16.34,11.23 24.11,3.47 24.11,2.64 AUX.3
  Bottom 0.127: v20.8,18.99 19.81,18 16.84,18 v16.34,18.49
D4  (via drill 0.61)
  Top 0.127: v19.48,18.82 20.14,18.16 21.13,18.16 21.63,18.66 21.63,19.15 21.79,19.32 24.11,19.32 24.6,18.82 25.09,18.82 U3.13
  Bottom 0.127: v19.48,18.82 19.48,20.97 16.68,23.77 7.1,23.77 5.12,25.76 4.46,25.76 1.98,23.28 1.98,19.32 ENCDAT.1
D5  (via drill 0.61)
  Top 0.127: v27.41,14.53 30.71,17.83 30.71,18.66 U3.24 | v16.18,6.11 14.69,6.11 14.36,5.78 U2.2 | v19.81,6.6 16.02,10.4 16.02,11.39 14.86,12.55 14.36,12.55 U1.2
  Bottom 0.127: v27.41,14.53 25.59,14.53 18.66,7.59 | 18.66,7.59 17.17,6.11 v16.18,6.11 | v19.81,6.6 18.82,7.59 18.66,7.59
D6  (via drill 0.61)
  Top 0.127: v30.05,22.29 32.03,22.29 U3.29 | v15.02,18.16 15.02,17 15.68,16.34 15.68,14.69 14.86,13.87 U1.3 | v17,7.1 14.36,7.1 U2.3
  Bottom 0.127: v30.05,22.29 28.73,22.29 24.11,17.67 19.65,17.67 | 19.65,17.67 15.52,17.67 v15.02,18.16 | v17,7.1 17.5,7.1 19.65,9.25 19.65,17.67
D8  (via drill 0.61)
  Top 0.127: U3.11 23.61,20.8 22.78,20.8 21.79,21.79 v17.5,21.79 | v18.82,10.24 19.15,10.24 26.75,2.64 AUX.2
  Bottom 0.127: v17.5,21.79 14.2,18.49 14.2,17.83 14.69,17.34 18,17.34 18.99,16.34 18.99,10.4 v18.82,10.24
D9
  Top 0.127: U3.12 23.61,20.14 23.44,19.98 19.48,19.98 18.66,19.15 18.66,16.34 22.95,12.05 22.95,8.91 29.22,2.64 AUX.1
D13/SCK
  Top 0.127: Q1.1 35.33,20.8 32.19,20.8 U3.26
GND  (via drill 0.35, 0.61)
  Top 0.127: 9.58,33.02 13.21,33.02 15.19,31.04 19.48,31.04 S1.2 | 9.58,33.02 7.1,33.02 6.27,32.19 6.27,31.86 6.44,31.7 6.44,30.71 C8.2 | U4.2 36.98,40.78 36.98,42.1 36.16,42.93 34.67,42.93 U5.3 34.51,42.93 34.01,42.93 v33.19,42.1 | 19.15,38.8 20.31,38.8 C4.2 | S1.1 19.48,35.17 19.48,35.66 18.33,36.82 18.33,38.14 18.99,38.8 C5.2 19.15,38.8 | C10.2 22.78,42.6 20.47,42.6 C3.2 20.31,42.43 19.15,42.43 | 19.15,42.43 11.89,42.43 7.59,38.14 7.59,37.81 C6.2 7.43,37.64 6.44,37.64 4.62,35.83 C1.2 4.62,35.66 5.61,34.67 5.61,33.02 5.45,32.85 5.45,29.88 6.44,28.89 C7.1 6.58,28.09 6.47,28.09 C9.2 7.37,26.3 7.37,26.08 7.71,26.03 7.87,26.02 8.13,26.02 8.62,25.92 8.67,25.9 9.08,25.79 9.13,25.78 9.83,25.03 10.11,24.75 10.12,24.72 10.22,24.47 10.74,24.22 11.15,24.25 C2.- | v19.15,40.45 19.15,38.8 | 19.15,42.43 v19.15,42.1 | v9.58,32.52 9.58,33.02 | 37.81,20.97 38.63,20.97 38.63,14.2 40.62,12.22 41.77,12.22 42.76,11.23 NJM.1 42.6,11.06 42.6,6.93 41.44,5.78 34.51,5.78 U6.4 | 37.81,20.97 36.82,20.97 Q1.2 | U6.1 30.71,5.78 31.7,5.78 U6.2 31.86,5.78 33.02,5.78 U6.3 | 30.54,10.24 29.22,10.24 28.07,11.39 R19.1 27.9,11.56 22.78,16.68 22.45,16.68 R21.2 | 30.54,10.24 30.87,10.24 31.2,10.57 31.2,10.73 31.7,11.23 U6.7 | 30.54,10.24 30.54,5.78 U6.1 | 9.75,5.77 10.07,5.45 10.57,5.45 U2.P$1 10.73,5.45 11.39,6.11 | 11.39,6.11 11.56,6.27 U2.GND | 11.39,6.11 12.05,5.45 U2.P$2 12.22,5.28 12.88,4.62 13.11,4.5 | 11.39,6.11 U2.GND | 11.56,7.92 12.05,7.43 U2.P$3 | 11.56,7.92 v11.36,8.08 | 11.56,7.92 U2.GND | 11.39,11.56 10.73,12.22 U1.P$1 10.57,12.38 10.4,12.55 8.59,12.55 U1.7 8.42,12.71 4.79,12.71 3.47,14.03 1.98,14.03 ENCPOW.1
  Top 0.127: U1.P$2 12.05,12.38 11.39,12.38 U1.GND | 11.39,13.54 11.56,13.37 U1.GND | 11.39,13.54 10.73,14.2 U1.P$4 10.68,18.14 11.06,18.52 10.74,18.93 10.74,19.34 C2.- | 11.39,13.54 12.05,14.2 U1.P$3 | 11.39,13.54 U1.GND | 11.39,11.56 v11.36,11.36 | 11.39,11.56 U1.GND | 28.73,25.92 28.23,26.42 28.23,27.08 U3.42 28.23,27.24 28.23,29.55 JP5.5 28.07,29.55 26.91,29.55 JP5.3 | 28.73,25.92 29.72,24.93 30.38,24.93 30.71,25.26 32.03,25.26 U3.35 32.19,25.26 33.02,25.26 33.35,25.59 33.35,30.05 34.51,31.2 36.32,31.2 CN1.GND 36.49,31.2 37.64,31.2 38.3,30.54 v38.3,29.72 | C2.- 13.54,22.12 15.19,23.77 18.16,23.77 18.99,24.6 21.79,24.6 22.62,23.77 23.61,23.77 U3.5 23.77,23.77 24.6,23.77 25.09,24.27 27.08,24.27 27.41,24.6 | 27.41,24.6 28.73,25.92 | 27.41,24.6 28.07,23.94 28.07,23.11 27.74,22.78 27.74,18.82 U3.18 | v27.41,5.61 30.54,5.61 U6.1 | v37.81,21.96 37.81,20.97
  Top 0.508: U1.1 13.06,11.33 13.06,11.36 v11.36,11.36
  Top 0.61: U2.P$4 v11.36,8.08 11.43,8.15 | U2.7 9.75,5.77 | v16.69,4.34 14.3,4.34 U2.1 13.11,4.5
  Bottom 0.127: v19.15,42.1 19.15,40.95 | v33.19,42.1 32.52,42.1 30.87,40.45 28.07,40.45 27.57,40.95 19.15,40.95 | 19.15,40.95 v19.15,40.45 18.16,40.45 10.24,32.52 v9.58,32.52 | v27.41,5.61 24.43,5.61 21.46,2.64 IN.2 | v37.81,21.96 37.81,29.22 v38.3,29.72
  Bottom 0.61: v11.36,8.08 v11.36,11.36 11.43,11.43 | IN.2 20.14,3.63 20.14,4.08 19.29,4.93 18.09,4.93 17.51,4.34 v16.69,4.34
MVIN  (via drill 0.35, 0.61)
  Top 0.127: v35.5,11.56 37.97,11.56 38.3,11.23 39.62,11.23 NJM.3
  Top 0.61: IN.1 18.69,6.91 15.77,9.83 10.08,9.83 v9.73,9.48 U2.5 | v4.8,15.77 7.92,15.77 | 7.92,15.77 U1.5 | 7.92,15.77 7.92,21.83 C2.+ 1.32,22 1.32,33.83 4.55,33.83 C1.1
  Bottom 0.127: v35.5,11.56 29.72,11.56 23.77,5.61 17,5.61 16.02,4.62 16.02,3.96 17.34,2.64 18.66,2.64 IN.1 | ENCPOW.2 1.98,11.72 1.98,12.55 3.47,14.03 3.47,14.36 3.96,14.86 4.62,14.86 4.8,14.97
  Bottom 0.61: v9.73,9.48 5.23,13.97 5.23,14.54 4.8,14.97 v4.8,15.77
N$1  (via drill 0.61)
  Top 0.127: v35.99,19.81 36.16,19.81 37.15,18.82 F1.1 | v35.99,27.08 35.99,27.74 36.32,28.07 CN1.VBUS
  Bottom 0.127: v35.99,27.08 v35.99,19.81
N$2
  Top 0.127: C7.2 7.59,28.89 7.59,29.22 7.1,29.72 6.11,29.72 5.78,30.05 5.78,32.69 6.44,33.35 13.37,33.35 15.02,31.7 20.14,31.7 20.31,31.53 20.31,30.38 21.96,28.73 22.29,28.73 Y1.P$2 22.45,28.56 23.61,27.41 23.61,25.76 U3.1
N$3
  Top 0.127: Q1.3 36.16,22.78 36.98,22.78 38.14,23.94 38.3,23.94 41.11,26.75 41.11,32.85 38.63,35.33 38.63,38.8 38.14,39.29 34.18,39.29 33.68,39.79 32.36,39.79 31.2,38.63 31.2,36.16 30.05,35 30.05,34.01 29.72,33.68 26.42,33.68 25.59,32.85 D3.C
N$4
  Top 0.127: C8.1 7.76,30.54 18,30.54 19.81,28.73 Y1.P$1 19.98,28.56 19.98,28.07 22.78,25.26 23.61,25.26 U3.2
N$5  (via drill 0.61)
  Top 0.127: v24.27,31.86 24.27,33.02 24.93,33.68 25.92,33.68 26.75,34.51 27.24,34.51 D2.A | v25.26,21.3 v25.26,23.28 | v15.19,34.51 15.19,35.83 R2.1
  Bottom 0.127: v24.27,31.86 24.27,24.27 v25.26,23.28 | v25.26,21.3 21.63,21.3 17.17,25.76 10.24,25.76 8.59,24.11 7.59,24.11 7.1,24.6 7.1,26.42 v15.19,34.51
N$6  (via drill 0.61)
  Top 0.127: v25.59,35.83 25.59,34.67 D3.A | v26.91,38.8 v26.91,37.15 | v13.87,34.51 13.87,35.5 13.54,35.83 R3.1
  Bottom 0.127: v26.91,37.15 v25.59,35.83 | v26.91,38.8 18.16,38.8 v13.87,34.51
N$7  (via drill 0.61)
  Top 0.127: v29.55,41.27 29.55,38.14 Q2.3 | v35.83,18.49 34.67,18.49 34.51,18.66 F1.2
  Bottom 0.127: v29.55,41.27 31.2,41.27 32.85,42.93 36.16,42.93 36.82,42.27 36.82,19.48 v35.83,18.49
N$8  (via drill 0.61)
  Top 0.127: R5.2 10.4,28.73 12.05,27.08 R4.1 12.22,27.08 13.37,27.08 v16.02,29.72 | 34.67,41.94 34.67,42.1 U5.2 34.67,41.94 | 34.67,41.94 34.67,41.27 U5.1 | v35.99,41.94 34.67,41.94 | v34.51,30.05 34.84,30.05 35.17,30.38 36.32,30.38 CN1.ID
  Bottom 0.127: 35.99,35.99 35.99,31.53 v34.51,30.05 | 35.99,35.99 v35.99,41.94 | v16.02,29.72 16.02,33.52 20.47,37.97 32.03,37.97 34.01,35.99 35.99,35.99
N$9
  Top 0.127: R7.1 30.38,36.82 30.38,40.12 Q2.1 30.54,40.28 30.54,41.11 31.86,42.43 31.86,42.93 U5.4
N$10
  Top 0.127: D1.A 31.04,35.17 33.02,37.15 R6.1
N$11
  Top 0.127: D4.A 29.06,34.67 28.56,34.67 26.91,36.32 26.25,36.32 25.43,37.15 R8.1
N$15  (via drill 0.61)
  Top 0.127: v16.84,24.93 18.66,24.93 19.48,25.76 19.81,25.76 R20.2 | v23.77,18.49 22.45,18.49 R21.1 | v30.71,16.68 30.71,11.39 U6.8
  Bottom 0.127: v16.84,24.93 17.34,24.93 v23.77,18.49 24.43,18.49 28.56,22.62 29.06,22.62 29.55,23.11 30.38,23.11 30.87,22.62 30.87,21.96 30.71,21.79 v30.71,16.68
N$20  (via drill 0.35)
  Top 0.508: v14.4,16.69 14.3,16.69 U1.4 | U2.4 15.77,8.31 v15.77,8.23
  Bottom 0.508: v14.4,16.69 17.78,16.69 R19.2 17.78,8.23 v15.77,8.23
OUT1  (via drill 0.35)
  Top 0.61: U2.6 6.46,7.04 6.05,7.44 5.99,7.44 v5.92,7.52 | v4.34,14.17 4.65,13.87 U1.6
  Bottom 0.61: OUT.2 4.12,9.14 | 4.12,9.14 4.12,7.77 4.42,7.47 | 4.42,7.47 4.42,7.09 | 4.42,7.47 5.92,7.47 v5.92,7.52 | 4.12,9.14 4.12,13.95 v4.34,14.17
OUT2
  Top 0.61: U2.8 5.71,4.5 4.8,5.41 4.8,6.63 | 4.8,6.63 5.03,6.63 5.03,11.33 U1.8 | 4.8,6.63 2.03,6.63 OUT.1
RX_LED
  Top 0.127: D4.C 29.06,32.69 28.56,32.69 27.57,31.7 25.26,31.7 24.43,30.87 24.43,27.9 25.09,27.24 U3.48
SCL
  Top 0.127: I2C.2 35.5,2.64 33.68,4.46 33.68,6.44 33.19,6.93 33.19,11.23 U6.6 33.02,11.39 33.02,17.83 29.22,21.63 29.22,22.62 30.38,23.77 32.03,23.77 U3.32
SDA  (via drill 0.61)
  Top 0.127: v34.34,9.58 34.34,11.23 U6.5 | v33.68,23.28 32.19,23.28 U3.31
  Bottom 0.127: 34.34,9.25 34.34,4.13 33.02,2.81 I2C.1 | v33.68,23.28 33.68,14.53 36.32,11.89 36.32,11.23 34.34,9.25 | 34.34,9.25 v34.34,9.58
SWCLK  (via drill 0.61)
  Top 0.127: v26.42,25.76 26.75,26.09 26.75,27.08 U3.45
  Bottom 0.127: v26.42,25.76 26.42,27.57 24.77,29.22 24.77,31.2 25.26,31.7 25.92,31.7 26.75,30.87 JP5.4
SWDIO
  Top 0.127: U3.46 26.25,27.24 26.25,28.07 25.59,28.73 25.26,28.73 24.77,29.22 24.77,30.05 25.43,30.71 JP5.2
TX_LED
  Top 0.127: D1.C 31.04,31.7 31.86,30.87 31.86,29.06 31.2,28.4 30.05,28.4 29.72,28.07 29.72,27.24 U3.39
USB_D+
  Top 0.127: CN1.D+ 35.33,29.72 34.51,28.89 34.51,26.25 33.02,24.77 32.19,24.77 U3.34
USB_D-
  Top 0.127: U3.33 32.19,24.27 33.02,24.27 34.84,26.09 34.84,28.4 35.33,28.89 36.32,28.89 CN1.D-
USB_HOST_EN  (via drill 0.61)
  Top 0.127: v13.87,28.73 12.22,28.73 R5.1 | v30.05,25.76 29.39,25.76 28.73,26.42 28.73,27.08 U3.41
  Bottom 0.127: v13.87,28.73 14.86,28.73 21.46,22.12 27.57,22.12 28.73,23.28 29.22,23.28 30.05,24.11 v30.05,25.76
VDDANA  (via drill 0.61)
  Top 0.127: v19.98,36.32 19.15,37.15 19.15,37.48 C5.1 | v21.63,37.15 22.78,37.15 L1.2 | v21.96,23.28 23.61,23.28 U3.6
  Bottom 0.127: 20.8,36.32 v19.98,36.32 | v21.63,37.15 20.8,36.32 | v21.96,23.28 21.96,35.17 20.8,36.32
VDDCORE
  Top 0.127: C4.1 20.47,37.48 20.47,37.15 23.61,34.01 23.61,32.36 23.44,32.19 23.44,28.07 24.77,26.75 24.77,26.25 26.09,24.93 26.75,24.93 27.74,25.92 27.74,27.08 U3.43
VIN  (via drill 0.61)
  Top 0.127: 9.25,27.08 8.42,27.08 C9.1 | 9.25,27.08 10.24,27.08 R4.2 10.4,26.91 11.39,25.92 18,25.92 R20.1 | R7.2 28.56,36.82 28.56,40.12 Q2.2 28.4,40.12 v27.24,40.12 | U4.1 37.97,40.62 37.97,40.12 37.48,39.62 36.82,39.62 36.32,40.12 36.32,40.62 U4.3 34.51,40.62 | 34.51,40.62 33.85,40.62 33.35,41.11 32.03,41.11 U5.5 31.86,41.11 31.53,40.78 | v9.25,29.72 9.25,27.08 | v34.51,40.12 34.51,40.62
  Bottom 0.127: v9.25,29.72 9.25,31.04 17.83,39.62 26.75,39.62 v27.24,40.12 v34.51,40.12

### Text on the board
Dimension: D D + -
tPlace: Designed by | John Reichard | Circuit Pro Industries | TX RX | + - | Motor | + - | AUX | SDA SCL